# EAGLE schematic Senior Design (EAGLE 9.1.3)
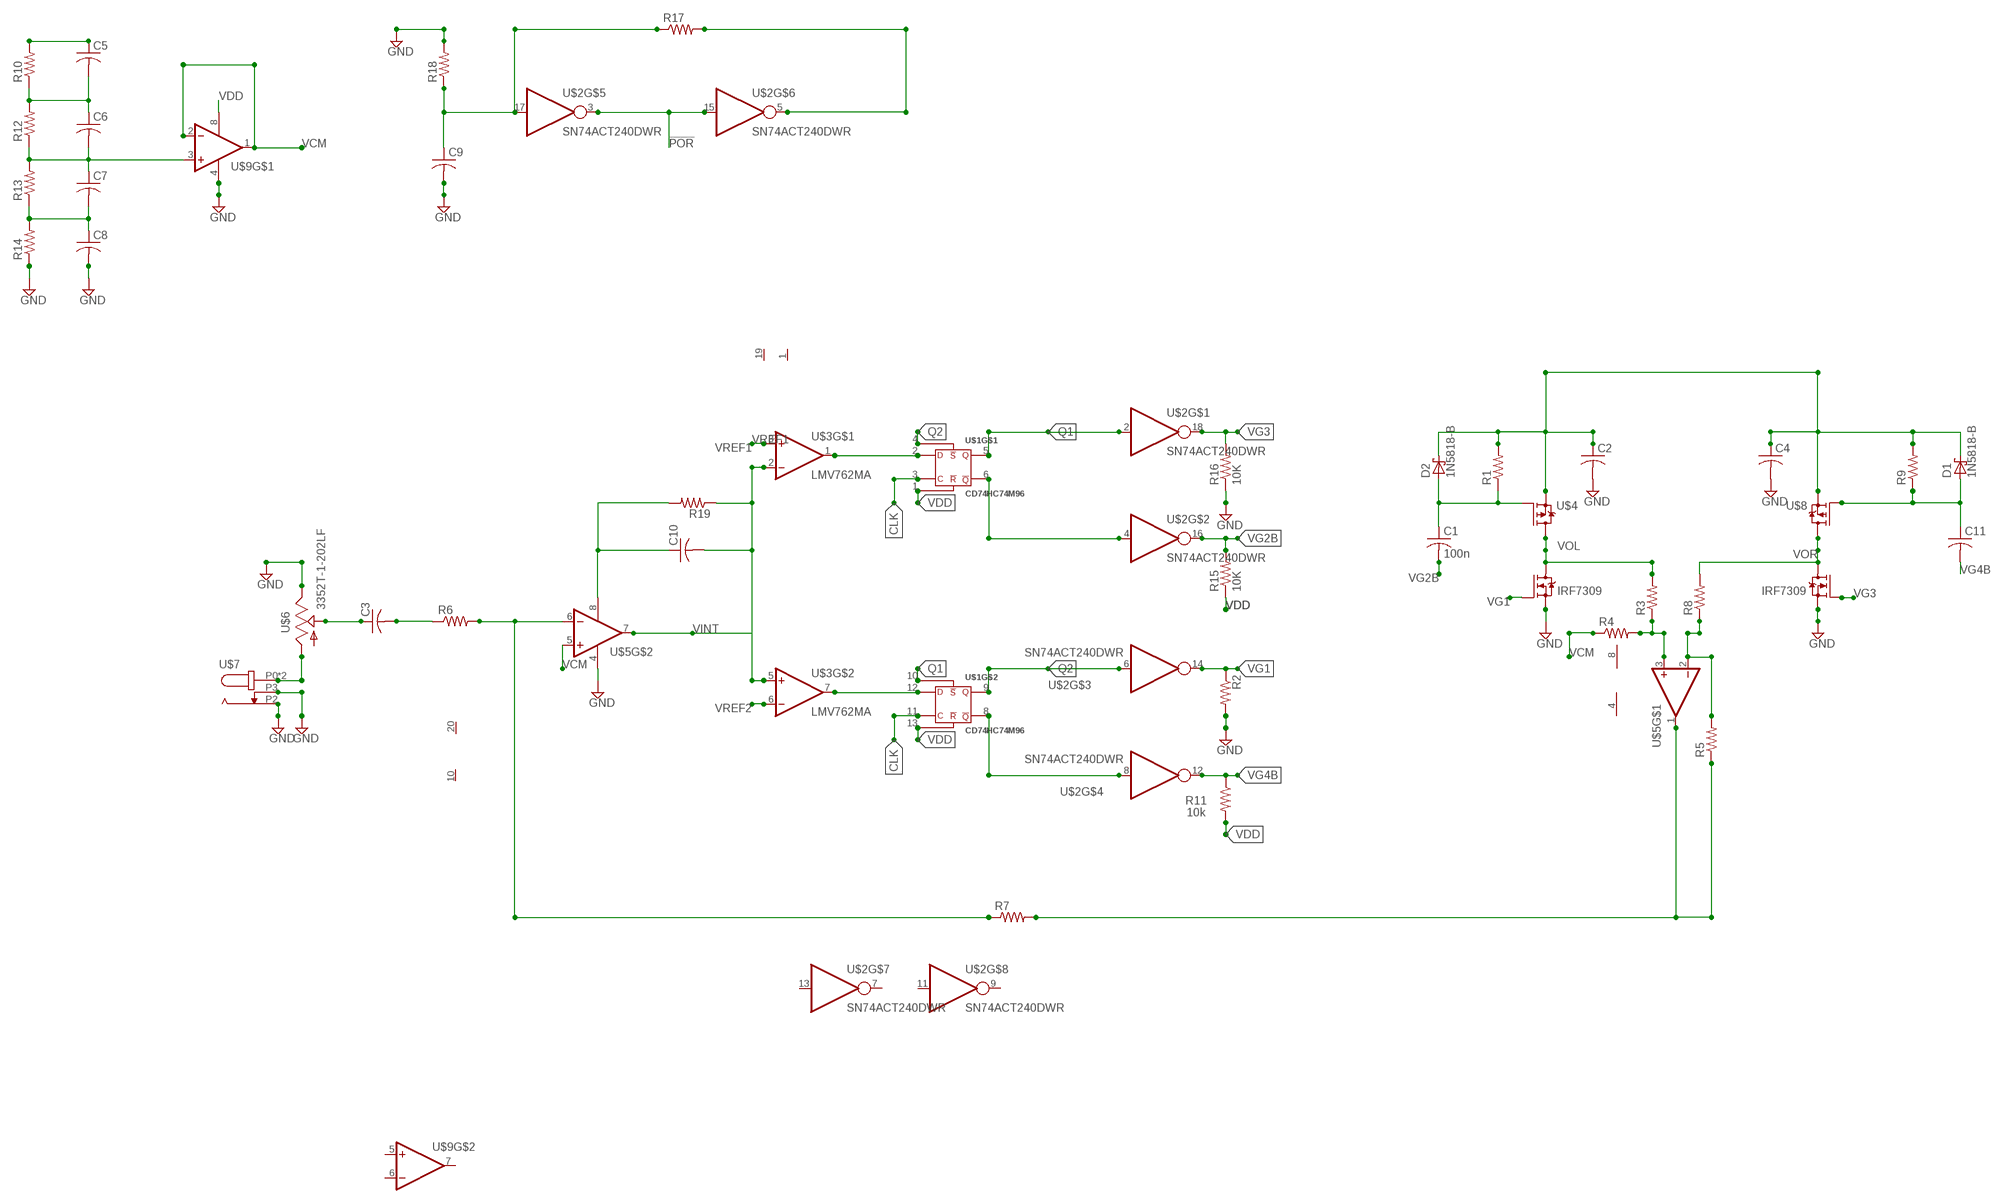
[diagram p0: schematic, sheet 1]

## Parts
C1  100n  C-USC0603  [C0603]
C2  C-USC0603  [C0603]
C3  C-USC0603  [C0603]
C4  C-USC0603  [C0603]
C5  C-USC0603  [C0603]
C6  C-USC0603  [C0603]
C7  C-USC0603  [C0603]
C8  C-USC0603  [C0603]
C9  C-USC0603  [C0603]
C10  C-USC0603  [C0603]
C11  C-USC0603  [C0603]
D1  1N5818-B  [DO41-7.6]
D2  1N5818-B  [DO41-7.6]
R1  R-US_R0603  [R0603]
R2  R-US_R0603  [R0603]
R3  R-US_R0603  [R0603]
R4  R-US_R0603  [R0603]
R5  R-US_R0603  [R0603]
R6  R-US_R0603  [R0603]
R7  R-US_R0603  [R0603]
R8  R-US_R0603  [R0603]
R9  R-US_R0603  [R0603]
R10  R-US_R0603  [R0603]
R11  10k  R-US_R0603  [R0603]
R12  R-US_R0603  [R0603]
R13  R-US_R0603  [R0603]
R14  R-US_R0603  [R0603]
R15  10K  R-US_R0603  [R0603]
R16  10K  R-US_R0603  [R0603]
R17  R-US_R0603  [R0603]
R18  R-US_R0603  [R0603]
R19  R-US_R0603  [R0603]
U$1  CD74HC74M96  [SOIC14]
U$2  SN74ACT240DWR  [SO-20]
U$3  LMV762MA  [SO-8]
U$4  IRF7309  [SO-8]
U$5  LMV797MM  [VSSOP-08]
U$6  3352T-1-202LF  [3352T]
U$7  PJ-014DH-SMT  [DC_POWER]
U$8  IRF7309  [SO-8]
U$9  LMV797MM  [VSSOP-08]

## Nets
!POR: U$2.3(OUT) U$2.15(IN)
CLK: U$1.11(C)
GND: C2.2 C4.2 C8.2 C9.2 C10.1 R2.2 R14.1 R16.1 R18.2 R19.2 U$4.1(N-S) U$5.4(VN) U$5.7(OUT) U$5.8(VP) U$6.P3 U$7.P2 U$7.P3 U$8.1(N-S) U$9.4(VN)
N$1: U$1.3(C)
N$2: U$1.6(QN) U$2.4(IN)
N$3: U$1.12(D) U$3.7(OUT)
N$4: U$1.8(QN) U$2.8(IN)
N$5: U$1.2(D) U$3.1(OUT)
N$6: C1.1 D2.A R1.1 U$4.4(P-G)
N$7: C7.2 C8.1 R13.1 R14.2
N$8: R3.1 R4.2 U$5.3(+)
N$9: R5.2 R8.1 U$5.2(-)
N$10: R5.1 R7.2 U$5.1(OUT)
N$11: C3.2 R6.1
N$12: C3.1 U$6.P2
N$13: R6.2 R7.1 U$5.6(-)
N$14: U$6.P1 U$7.P0 U$7.P1
N$15: C2.1 C4.1 D1.C D2.C R1.2 R9.2 U$4.3(P-S) U$8.3(P-S)
N$16: C11.1 D1.A R9.1 U$8.4(P-G)
N$17: C6.2 C7.1 R12.1 R13.2 U$9.3(+)
N$18: C5.2 C6.1 R10.1 R12.2
N$19: C9.1 R17.1 R18.1 U$2.17(IN)
N$21: R17.2 U$2.5(OUT)
N$22: C5.1 R10.2
Q1: U$1.5(Q) U$1.10(S) U$2.2(IN)
Q2: U$1.4(S) U$1.9(Q) U$2.6(IN)
VCM: R4.1 U$5.5(+) U$9.1(OUT) U$9.2(-)
VDD: R11.2 R15.1 U$1.1(R) U$1.13(R) U$9.8(VP)
VG1: R2.1 U$2.14(OUT) U$4.2(N-G)
VG2B: C1.2 R15.2 U$2.16(OUT)
VG3: R16.2 U$2.18(OUT) U$8.2(N-G)
VG4B: C11.2 R11.1 U$2.12(OUT)
VINT: C10.2 R19.1 U$3.2(-) U$3.5(+)
VOL: R3.2 U$4.5(P-D) U$4.6(P-D) U$4.7(N-D) U$4.8(N-D)
VOR: R8.2 U$8.5(P-D) U$8.6(P-D) U$8.7(N-D) U$8.8(N-D)
VREF1: U$3.3(+)
VREF2: U$3.6(-)
Unconnected: U$1.7(GND) U$1.14(VIN) U$2.1(!EN) U$2.7(OUT) U$2.9(OUT) U$2.10(GND) U$2.11(IN) U$2.13(IN) U$2.19(!EN) U$2.20(VIN) U$3.4(VN) U$3.8(VP) U$9.5(+) U$9.6(-) U$9.7(OUT)

## Library data of the parts
C1-C11 = rcl:C-US: CAPACITOR, American symbol; SPICEPREFIX: C
D1 D2 = diode:1N581*: 1.0A SCHOTTKY BARRIER RECTIFIER Source: http://www.diodes.com/datasheets/ds23001.pdf
R1 R3-R10 R12-R14 R17-R19 = rcl:R-US_: RESISTOR, American symbol; SPICEPREFIX: R
R2 R11 R15 R16 = rcl:R-US_: RESISTOR, American symbol
U$1 = ECE380:CD74HC74M96: Dual D Flip Flop
U$2 = ECE380:SN74ACT240DWR: Octal Buffer
U$3 = ECE380:LMV762MA: Dual Comparator
U$4 U$8 = ECE380:IRF7309: IRF7309 PMOS and NMOS
U$5 U$9 = ECE380:LMV797MM: LMV797MM Op amp
U$6 = ECE380:3352T-1-202LF: Potentiometer 2K
U$7 = ECE380:PJ-014DH-SMT: DC Power Jack